# EasyEDA Pro project ProPrj_主控板v1.0_2025-02-24.epro, board PCB1
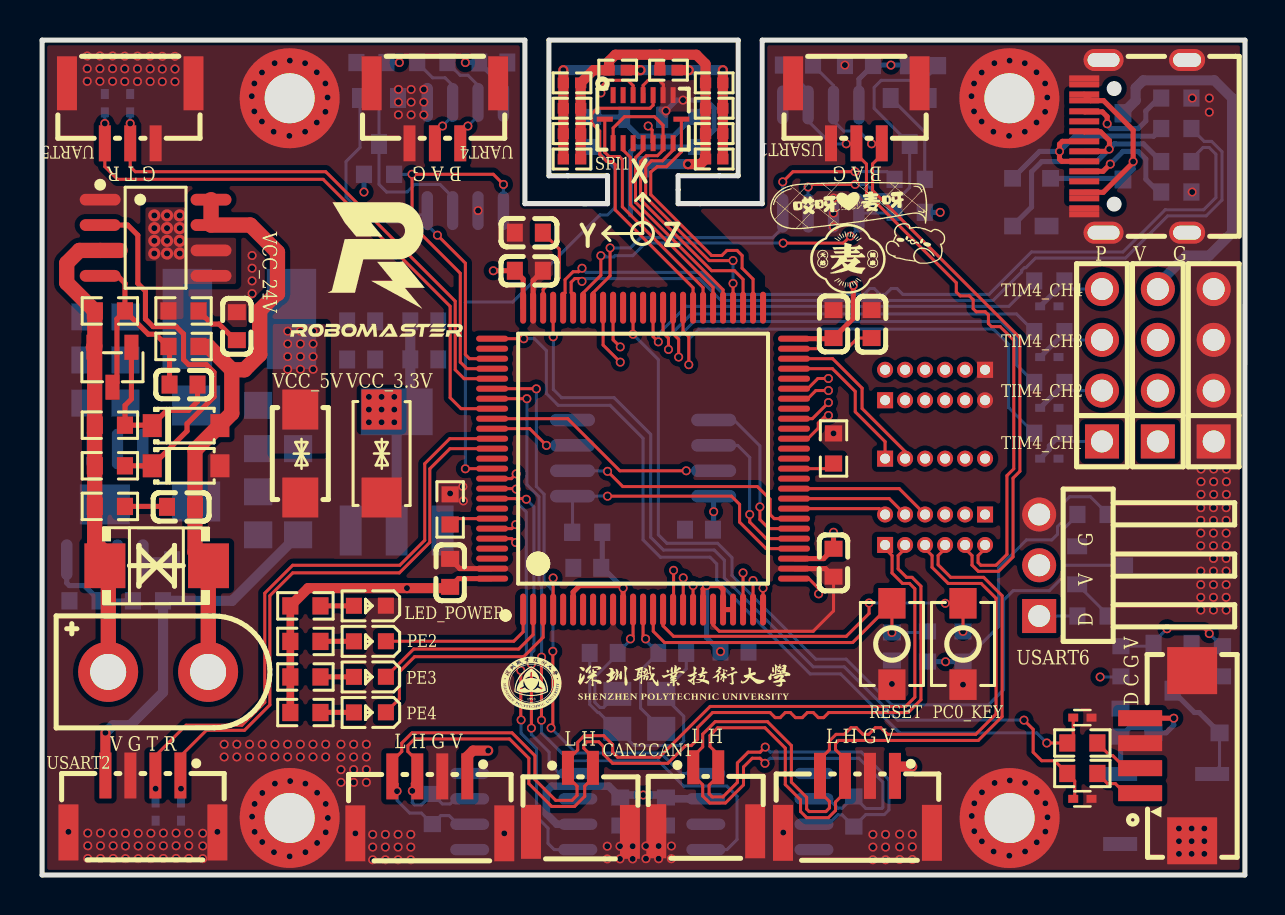
[diagram p8: board, top side]
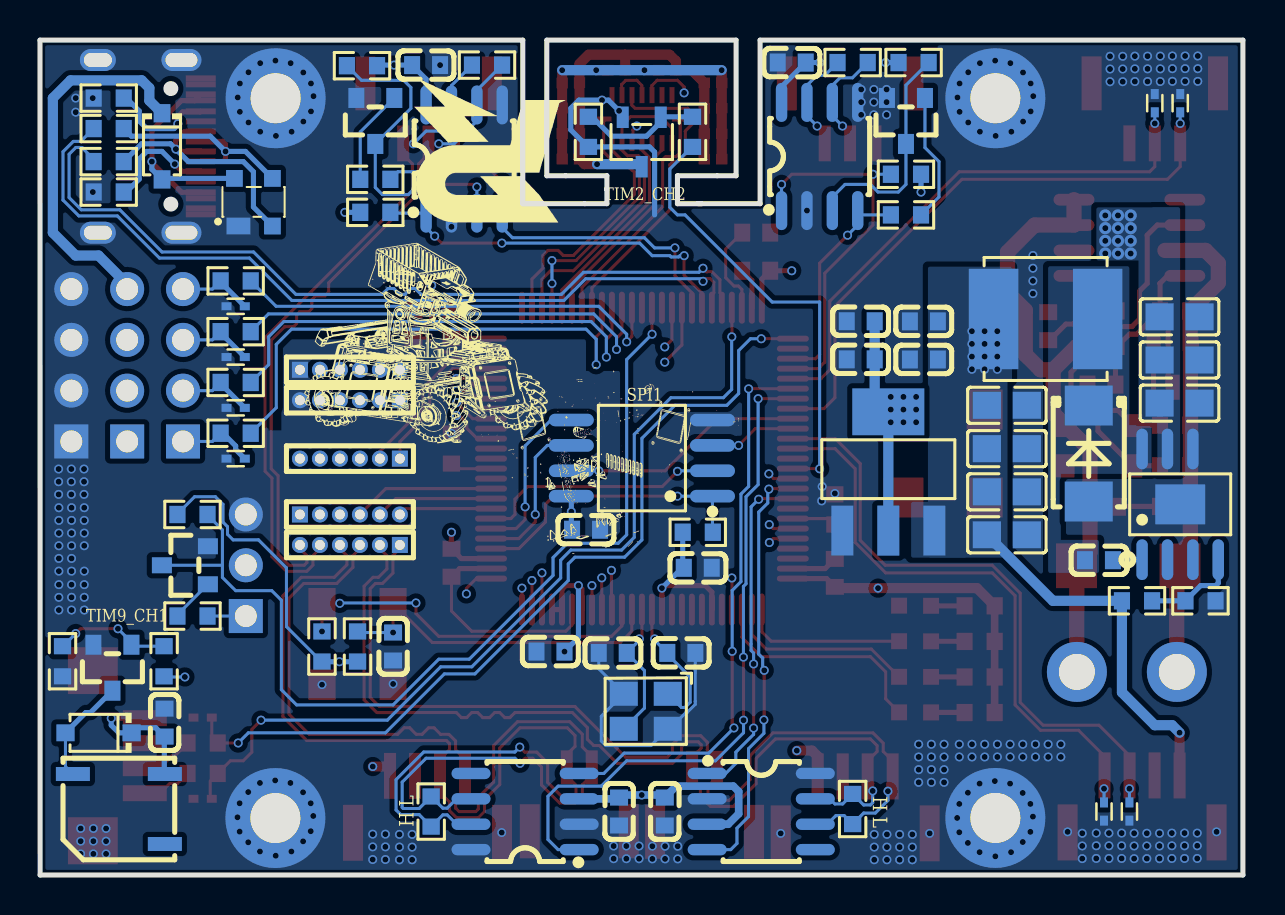
[diagram p9: board, bottom side, seen from below]

Outline 60.17 x 41.76 mm; copper layers: Top Layer, Inner1, Inner2, Bottom Layer. Coordinates in mm from the lower left corner of the outline.
Outline path: 27.24,33.58 24.15,33.58 24.15,41.76 0,41.76 0,0 60.16,0 60.17,41.76 36.02,41.76 36.02,33.58 31.81,33.58 31.81,34.98 34.82,34.98 34.82,41.76 25.35,41.76 25.35,34.98 28.28,34.98 28.28,33.58 27.07,33.58
Stack: Top Layer 0.035mm 外层铜厚1oz / Dielectric1 0.2104mm 7628 RC49% 8.6mil / Inner1 0.0152mm 内层铜厚 / Dielectric2 1.065mm 1.1mm H/HOZ 含铜 / Inner2 0.0152mm 内层铜厚 / Dielectric3 0.2104mm 7628 RC49% 8.6mil / Bottom Layer 0.035mm 外层铜厚1oz

## Design rules (mm)
net OSC_IN: OSC
net OSC_OUT: OSC
net CAN1-H: CAN1
net CAN1-L: CAN1
net CAN2-H: CAN2
net CAN2-L: CAN2
net RS485_1_B: RS485_1
net RS485_1_A: RS485_1
net RS485_4_B: RS485_4
net RS485_4_A: RS485_4
net $1N15439: USB
net $1N15440: USB
template: 自定义配置
spacing copperThickness1oz (default): track to track 0.102, other pairs 0.152 to 0.3
spacing copperThickness2oz: track to track 0.203, other pairs 0.152 to 0.3
track width copperThickness1oz (default): min 0.127, default 0.254, max 2.54
track width copperThickness2oz: min 0.203, default 0.254, max 2.54
differential pair differentialPair (default): width min 0.127, default 0.254, max 2.54; gap min 0.152, default 0.152
via viaSize (default): diameter min 0.3, default 0.3, max 10; hole min 0.3, default 0.45, max 6.3

## Placement (name value [footprint] x y rotation side)
BUZZER2  4kHz  [BUZ-SMD_L5.0-W5.5-P4.60]  56.22 3.3 0 bottom
C1  100nF  [C0603]  7.07 24.53 180 top
C3  1uF  [C0603]  6.95 18.42 180 top
C4  1uF  [C0603]  9.74 27.45 90 top
C8  100nF  [C0603]  7.2 15.75 0 bottom
C17  12pF  [C0603]  28.09 11.11 180 bottom
C18  12pF  [C0603]  31.52 11.11 0 bottom
C19  100nF  [C0603]  42.51 11.43 270 bottom
C54  100nF  [C0603]  31.2 3.17 270 bottom
C132  4.7uf  [C0805]  3.17 23.6 0 bottom
C133  4.7uf  [C0805]  3.17 25.76 0 bottom
C163  4.7uf  [C0805]  3.17 27.92 0 bottom
C164  4.7uf  [C0805]  11.81 17.02 0 bottom
C165  4.7uf  [C0805]  11.81 19.17 0 bottom
C166  4.7uf  [C0805]  11.81 21.33 0 bottom
C167  4.7uf  [C0805]  11.81 23.5 0 bottom
C170  100nF  [C0603]  34.63 11.18 180 bottom
C171  100nF  [C0603]  20.41 15.11 270 top
C174  100nF  [C0603]  27.27 15.37 0 bottom
C175  100nF  [C0603]  39.59 27.56 270 top
C176  100nF  [C0603]  24.35 30.23 180 top
C177  100nF  [C0603]  39.59 15.62 90 top
C178  100nF  [C0603]  28.92 3.17 270 bottom
C179  10nF  [C0603]  19.12 27.7 180 bottom
C180  100nF  [C0603]  19.12 25.79 180 bottom
C181  100nF  [C0603]  15.96 27.69 180 bottom
C182  100nF  [C0603]  15.96 25.79 180 bottom
C183  22uF  [C0603]  53.94 7.62 270 bottom
C184  100nF  [C0603]  41.49 27.56 90 top
C185  100nF  [C0603]  24.35 32.13 180 top
C186  100nF  [C0603]  32.86 17.27 180 bottom
C187  100nF  [C0603]  40.86 40.51 180 bottom
C188  100nF  [C0603]  22.57 40.64 0 bottom
CN1  HC-1.25-4PWT  [CONN-SMD_4P-P1.25-HC-1.25-4PWT]  56.22 5.97 90 top
CN11  GH1.25-2P卧贴  [CONN-SMD_2P-P1.25_X1251WRS-02HF-LPSW]  33.19 3.79 0 top
CN12  GH1.25-2P卧贴  [CONN-SMD_2P-P1.25_X1251WRS-02HF-LPSW]  26.93 3.76 0 top
D4  -  [SMB_L4.6-W3.6-LS5.3-BI]  5.73 15.47 180 top
D5  SS34-SMB  [SMB_L4.4-W3.6-LS5.3-RD]  7.71 21.08 270 bottom
D6  ESD9B5.0ST5G  [SOD-923_L0.8-W0.6-LS1.0-BI]  52.03 7.87 180 top
D7  ESD9B5.0ST5G  [SOD-923_L0.8-W0.6-LS1.0-BI]  52.03 3.81 180 top
D8  PRTR5V0U2X  [SOT-143-4_L2.9-W1.3-P1.92-LS2.4-BL]  49.49 33.66 180 bottom
D10  ESD9B5.0ST5G  [SOD-923_L0.8-W0.6-LS1.0-BI]  50.38 20.83 180 bottom
D11  ESD9B5.0ST5G  [SOD-923_L0.8-W0.6-LS1.0-BI]  50.38 23.37 180 bottom
D12  ESD9B5.0ST5G  [SOD-923_L0.8-W0.6-LS1.0-BI]  50.38 25.91 180 bottom
D13  ESD9B5.0ST5G  [SOD-923_L0.8-W0.6-LS1.0-BI]  50.38 28.45 180 bottom
D19  ESD9B5.0ST5G  [SOD-923_L0.8-W0.6-LS1.0-BI]  3.14 38.61 270 bottom
D20  ESD9B5.0ST5G  [SOD-923_L0.8-W0.6-LS1.0-BI]  4.41 38.61 270 bottom
D21  SMAJ5.0CA  [SMA_L4.4-W2.8-LS5.1-BI]  12.92 21.08 90 top
D22  SMAJ3.3CA  [SMA_L4.3-W2.6-LS5.1-BI]  16.98 21.08 90 top
D23  ESD9B5.0ST5G  [SOD-923_L0.8-W0.6-LS1.0-BI]  6.95 3.17 90 bottom
D24  ESD9B5.0ST5G  [SOD-923_L0.8-W0.6-LS1.0-BI]  5.68 3.17 90 bottom
H2  -  [HDR-TH_4P-P2.54-V-M]  53.01 25.5 90 top
H3  -  [HDR-TH_4P-P2.54-V-M]  55.81 25.5 90 top
H4  -  [HDR-TH_4P-P2.54-V-M]  58.6 25.5 90 top
L2  15uH  [IND-SMD_L6.0-W6.0_SWPA6045S]  9.87 27.81 0 bottom
LED2  -  [LED_0603]  16.35 13.46 180 top
LED3  -  [LED_0603]  16.35 11.68 180 top
LED4  -  [LED_0603]  16.35 9.91 180 top
LED5  -  [LED_0603]  16.35 8.13 180 top
NOREF  -  [Pad_e5542]  12.38 38.85 90 top
NOREF#2  -  [Pad_e5538]  48.38 38.86 90 top
NOREF#3  -  [Pad_e5541]  12.38 2.86 90 top
NOREF#4  -  [Pad_e5539]  48.39 2.85 90 top
Q6  -  [S8050_SOT-23]  52.92 15.37 180 bottom
Q29  NCE4614  [SOIC-8_L4.9-W3.9-P1.27-LS6.0-BL]  5.68 31.88 270 top
Q30  -  [SOT-23-3_L2.9-W1.3-P1.90-LS2.4-BR]  3.52 25.4 90 top
Q31  -  [S8050_SOT-23]  56.42 10.37 90 bottom
Q32  CJ2310  [SOT-23-3_L2.9-W1.6-P1.90-LS2.8-BR]  30.07 36.67 90 bottom
Q33  -  [S8050_SOT-23]  43.27 37.72 90 bottom
Q34  -  [S8050_SOT-23]  16.73 37.72 90 bottom
R2  100kΩ  [R0603]  3.39 20.47 180 top
R3  100kΩ  [R0603]  3.39 22.5 180 top
R4  22Ω  [R0603]  7.07 28.22 180 top
R6  10kΩ  [R0603]  3.39 28.22 180 top
R13  10K  [R0603]  44.29 11.43 270 bottom
R14  10K  [R0603]  13.17 13.46 0 top
R16  10K  [R0603]  20.41 18.29 270 top
R20  4.7k  [R0603]  5.3 13.72 0 bottom
R95  1.5k  [R0603]  2.12 13.72 0 bottom
R150  120R  [R0603]  19.52 3.3 90 bottom
R151  120R  [R0603]  40.6 3.17 270 bottom
R152  22Ω  [R0603]  3.39 18.44 180 top
R153  10kΩ  [R0603]  7.07 26.44 180 top
R154  4.7kΩ  [R0603]  52.54 18.03 180 bottom
R155  4.7kΩ  [R0603]  52.54 12.95 180 bottom
R156  22R  [R0603]  52.03 6.6 0 top
R157  22R  [R0603]  52.03 5.08 0 top
R158  10K  [R0603]  46.06 11.43 270 bottom
R159  10K  [R0603]  59.04 10.69 270 bottom
R160  22R  [R0603]  53.96 10.69 90 bottom
R161  22R  [R0603]  56.73 38.86 180 bottom
R162  22R  [R0603]  56.73 34.16 0 bottom
R163  100R  [R0603]  27.53 37.17 90 bottom
R164  10K  [R0603]  32.74 37.17 270 bottom
R165  470R  [R0402]  26.51 37.08 180 top
R166  470R  [R0402]  26.51 38.35 180 top
R167  470R  [R0402]  26.51 39.62 180 top
R168  470R  [R0402]  28.79 40.26 0 top
R169  470R  [R0402]  31.33 40.26 0 top
R170  470R  [R0402]  33.62 39.62 0 top
R171  470R  [R0402]  33.62 38.35 0 top
R172  470R  [R0402]  33.62 37.08 0 top
R173  470R  [R0402]  33.62 35.81 0 top
R174  470R  [R0402]  26.51 35.81 180 top
R175  10K  [R0603]  13.17 11.68 0 top
R176  10K  [R0603]  13.17 9.91 0 top
R177  10K  [R0603]  13.17 8.13 0 top
R178  22R  [R0603]  50.38 22.1 0 bottom
R179  22R  [R0603]  50.38 24.64 0 bottom
R180  22R  [R0603]  50.38 27.18 0 bottom
R181  22R  [R0603]  50.38 29.72 0 bottom
R182  22R  [R0603]  56.73 37.34 0 bottom
R183  22R  [R0603]  56.73 35.69 0 bottom
R184  10K  [R0603]  27.27 17.14 0 bottom
R185  10k  [R0603]  43.4 33.15 0 bottom
R186  120R  [R0603]  37.81 40.51 0 bottom
R187  10k  [R0603]  44.06 40.48 180 bottom
R188  10k  [R0603]  43.4 34.8 180 bottom
R189  10k  [R0603]  16.85 35.05 180 bottom
R190  120R  [R0603]  19.52 40.64 0 bottom
R191  10k  [R0603]  16.47 40.64 0 bottom
R192  10k  [R0603]  16.85 33.02 0 bottom
R193  10K  [R0603]  39.59 21.34 270 top
SW1  轻触按键3*4*H  [SW-SMD_L4.0-W2.9-LS5.0]  42.51 11.56 90 top
SW2  轻触按键3*4*H  [SW-SMD_L4.0-W2.9-LS5.0]  46.06 11.56 270 top
U1  STM32F407VET6  [LQFP-100_L14.0-W14.0-P0.50-LS16.0-BL]  30.06 20.83 0 top
U4  -  [SOIC-8_L5.0-W4.0-P1.27-LS6.0-BL-EP2.0]  3.14 18.54 180 bottom
U9  BMI088  [LGA-16_L4.5-W3.0-P0.50-BL]  30.06 37.81 270 top
U10  -  [SOIC-8_L5.0-W4.0-P1.27-LS6.0-BL]  24.09 3.17 270 bottom
U12  -  [SOIC-8_L5.0-W4.0-P1.27-LS6.0-BL]  35.9 3.17 90 bottom
U15  AMS1117-3.3  [SOT-223-3_L6.5-W3.4-P2.30-LS7.0-BR]  17.74 20.2 270 bottom
U18  X6511WR-03H-C30D60R2  [HDR-TH_3P-P2.54-H-M-W9.7-N]  49.87 15.49 90 top
U19  SD103AWS  [SOD-123_L2.7-W1.7-LS3.8-RD]  57.24 7.11 0 bottom
U20  SD103AWS  [SOD-123_L2.7-W1.7-LS3.8-RD]  54.06 36.45 270 bottom
U22  W25Q64JVSSIQ  [SOIC-8_L5.3-W5.3-P1.27-LS8.0-BL]  30.06 20.86 90 bottom
U24  SP3485EN-L/TR  [SOIC-8_L5.0-W4.0-P1.27-LS6.0-BL]  38.95 35.81 180 bottom
U27  SP3485EN-L/TR  [SOIC-8_L5.0-W4.0-P1.27-LS6.0-BL]  21.17 35.94 180 bottom
U31  GH1.25-4P卧贴  [CONN-SMD_4P-P1.25_GH1.25-4P]  19.39 3.51 0 top
U32  GH1.25-4P卧贴  [CONN-SMD_4P-P1.25_GH1.25-4P]  40.78 3.53 0 top
U33  GH1.25-4P卧贴  [CONN-SMD_4P-P1.25_GH1.25-4P]  5.04 3.56 0 top
U34  GH1.25-3PWBPZ  [CONN-SMD_GH1.25-3PWBPZ]  40.73 38.1 180 top
U35  GH1.25-3PWBPZ  [CONN-SMD_GH1.25-3PWBPZ]  19.65 38.1 180 top
U36  GH1.25-3PWBPZ  [CONN-SMD_GH1.25-3PWBPZ]  4.41 38.1 180 top
U37  XT30AW-M.G.Y  [CONN-TH_XT30AW-M.G.Y]  5.8 10.16 0 top
U38  HX PZ1.0-1x6P ZZ  [HDR-TH_6P-P1.00-V-M]  44.67 20.83 0 bottom
U39  HX PZ1.0-1x6P ZZ  [HDR-TH_6P-P1.00-V-M]  44.67 18.03 180 bottom
U40  HX PZ1.0-1x6P ZZ  [HDR-TH_6P-P1.00-V-M]  44.67 16.51 0 bottom
U41  HX PZ1.0-1x6P ZZ  [HDR-TH_6P-P1.00-V-M]  44.67 25.27 180 bottom
U42  HX PZ1.0-1x6P ZZ  [HDR-TH_6P-P1.00-V-M]  44.67 23.75 0 bottom
USB1  TYPE-C母座16P不绣钢  [TYPE-C-SMD_16P-EH4]  54.7 36.45 90 top
X3  12MHz  [OSC-SMD_4P-L3.2-W2.5-BL]  29.87 8.19 0 bottom
ZD1  MMSZ5239B  [SOD-123_L2.8-W1.8-LS3.7-RD]  7.2 20.47 0 top
ZD3  MMSZ5256B  [SOD-123_L2.8-W1.8-LS3.7-RD]  7.2 22.48 0 top

## Footprints (pads in the part's own frame, mm; a bottom-side part is the same pattern mirrored in y, then rotated)
BUZ-SMD_L5.0-W5.5-P4.60
  rect 1.7x0.7 smd: 1(-2.3,-1.75) 2(2.3,-1.75) 3(-2.3,1.75)
C0603
  rect 0.8x0.9 smd: 1(-0.7,0) 2(0.7,0)
C0805
  rect 1.41x1.35 smd: 1(-1,0) 2(1,0)
CONN-SMD_2P-P1.25_X1251WRS-02HF-LPSW
  rect 0.6x1.7 smd: 1(-0.625,1.6) 2(0.625,1.6)
  rect 1x2.7 smd: 3(2.475,-1.6) 4(-2.475,-1.6)
CONN-SMD_4P-P1.25-HC-1.25-4PWT
  rect 0.8x2.2 smd: 1(-1.875,1.3) 2(-0.625,1.3) 3(0.625,1.3) 4(1.875,1.3)
  rect 2.35x2.5 smd: 5(4.255,-1.3) 6(-4.255,-1.3)
CONN-SMD_4P-P1.25_GH1.25-4P
  rect 0.6x2.3 smd: 1(1.875,1.425) 2(0.625,1.425) 3(-0.625,1.425) 4(-1.875,1.425)
  rect 1x2.8 smd: 5(-3.725,-1.425) 6(3.725,-1.425)
CONN-SMD_GH1.25-3PWBPZ
  rect 0.6x1.8 smd: 1(-1.27,1.501) 2(0,1.501) 3(1.27,1.501)
  rect 1x2.7 smd: 4(-3.163,-1.501) 5(3.163,-1.501)
CONN-TH_XT30AW-M.G.Y
  round 3 hole 1.8: 1(-2.5,0) 2(2.5,0)
HDR-TH_3P-P2.54-H-M-W9.7-N
  rect 1.7x1.7 hole 1.1: 1(-2.54,0)
  round 1.7 hole 1.1: 2(0,0) 3(2.54,0)
HDR-TH_4P-P2.54-V-M
  rect 1.7x1.7 hole 1.1: 1(-3.81,0)
  round 1.7 hole 1.1: 2(-1.27,0) 3(1.27,0) 4(3.81,0)
HDR-TH_6P-P1.00-V-M
  rect 0.8x0.8 hole 0.5: 1(-2.5,0)
  round 0.8 hole 0.5: 2(-1.5,0) 3(-0.5,0) 4(0.5,0) 5(1.5,0) 6(2.5,0)
IND-SMD_L6.0-W6.0_SWPA6045S
  rect 2.474x5.02 smd: 1(-2.603,0) 2(2.603,0)
LED_0603
  rect 0.8x0.8 smd: 1(-0.851,-0.01) 2(0.75,-0.005)
LGA-16_L4.5-W3.0-P0.50-BL
  rect 0.8x0.25 smd: 1(-1.2,-1.498) 2(-1.2,-0.998) 3(-1.2,-0.498) 4(-1.2,0.002) 5(-1.2,0.502) 6(-1.2,1.002) 7(-1.2,1.502) 9(1.2,1.502) 10(1.2,1.002) 11(1.2,0.502) 12(1.2,0.002) 13(1.2,-0.498) 14(1.2,-0.998) 15(1.2,-1.498)
  rect 0.25x0.8 smd: 8(0,1.915) 16(0,-1.915)
LQFP-100_L14.0-W14.0-P0.50-LS16.0-BL
  oval 0.3x1.6 smd: 1(-6,-7.55) 2(-5.5,-7.55) 3(-5,-7.55) 4(-4.5,-7.55) 5(-4,-7.55) 6(-3.5,-7.55) 7(-3,-7.55) 8(-2.5,-7.55) 9(-2,-7.55) 10(-1.5,-7.55) 11(-1,-7.55) 12(-0.5,-7.55) 13(0,-7.55) 14(0.5,-7.55) 15(1,-7.55) 16(1.5,-7.55) 17(2,-7.55) 18(2.5,-7.55) 19(3,-7.55) 20(3.5,-7.55) 21(4,-7.55) 22(4.5,-7.55) 23(5,-7.55) 24(5.5,-7.55) 25(6,-7.55) 51(6,7.55) 52(5.5,7.55) 53(5,7.55) 54(4.5,7.55) 55(4,7.55) 56(3.5,7.55) 57(3,7.55) 58(2.5,7.55) 59(2,7.55) 60(1.5,7.55) 61(1,7.55) 62(0.5,7.55) 63(0,7.55) 64(-0.5,7.55) 65(-1,7.55) 66(-1.5,7.55) 67(-2,7.55) 68(-2.5,7.55) 69(-3,7.55) 70(-3.5,7.55) 71(-4,7.55) 72(-4.5,7.55) 73(-5,7.55) 74(-5.5,7.55) 75(-6,7.55)
  oval 1.6x0.3 smd: 26(7.55,-6) 27(7.55,-5.5) 28(7.55,-5) 29(7.55,-4.5) 30(7.55,-4) 31(7.55,-3.5) 32(7.55,-3) 33(7.55,-2.5) 34(7.55,-2) 35(7.55,-1.5) 36(7.55,-1) 37(7.55,-0.5) 38(7.55,0) 39(7.55,0.5) 40(7.55,1) 41(7.55,1.5) 42(7.55,2) 43(7.55,2.5) 44(7.55,3) 45(7.55,3.5) 46(7.55,4) 47(7.55,4.5) 48(7.55,5) 49(7.55,5.5) 50(7.55,6) 76(-7.55,6) 77(-7.55,5.5) 78(-7.55,5) 79(-7.55,4.5) 80(-7.55,4) 81(-7.55,3.5) 82(-7.55,3) 83(-7.55,2.5) 84(-7.55,2) 85(-7.55,1.5) 86(-7.55,1) 87(-7.55,0.5) 88(-7.55,0) 89(-7.55,-0.5) 90(-7.55,-1) 91(-7.55,-1.5) 92(-7.55,-2) 93(-7.55,-2.5) 94(-7.55,-3) 95(-7.55,-3.5) 96(-7.55,-4) 97(-7.55,-4.5) 98(-7.55,-5) 99(-7.55,-5.5) 100(-7.55,-6)
OSC-SMD_4P-L3.2-W2.5-BL
  rect 1.4x1.2 smd: 1(-1.1,-0.875) 2(1.1,-0.875) 3(1.1,0.875) 4(-1.1,0.875)
Pad_e5538
  round 5 hole 2.5: 101(0,0)
Pad_e5539
  round 5 hole 2.5: 101(0,0)
Pad_e5541
  round 5 hole 2.5: 101(0,0)
Pad_e5542
  round 5 hole 2.5: 101(0,0)
R0402
  rect 0.566x0.54 smd: 1(-0.433,0) 2(0.433,0)
R0603
  rect 0.806x0.864 smd: 1(-0.753,0) 2(0.753,0)
S8050_SOT-23
  rect 1x0.8 smd: 1(1.15,-0.823) 2(1.15,1.077) 3(-1.15,0.127)
SMA_L4.3-W2.6-LS5.1-BI
  rect 2x2 smd: 1(-2.2,0) 2(2.2,0)
SMA_L4.4-W2.8-LS5.1-BI
  rect 2x1.8 smd: 1(-2.2,0) 2(2.2,0)
SMB_L4.4-W3.6-LS5.3-RD
  rect 2x2.4 smd: 1(-2.4,0) 2(2.4,0)
SMB_L4.6-W3.6-LS5.3-BI
  rect 2.047x2.24 smd: 1(-2.591,0) 2(2.591,0)
SOD-123_L2.7-W1.7-LS3.8-RD
  rect 0.91x0.84 smd: 1(-1.655,0) 2(1.655,0)
SOD-123_L2.8-W1.8-LS3.7-RD
  rect 0.95x1.15 smd: 1(-1.692,0) 2(1.692,0)
SOD-923_L0.8-W0.6-LS1.0-BI
  rect 0.5x0.4 smd: 1(-0.457,0) 2(0.457,0)
SOIC-8_L4.9-W3.9-P1.27-LS6.0-BL
  oval 0.588x2.045 smd: 1(-1.905,-2.772) 2(-0.635,-2.772) 3(0.635,-2.772) 4(1.905,-2.772) 5(1.905,2.772) 6(0.635,2.772) 7(-0.635,2.772) 8(-1.905,2.772)
SOIC-8_L5.0-W4.0-P1.27-LS6.0-BL
  oval 0.569x1.95 smd: 1(-1.905,-2.705) 2(-0.635,-2.705) 3(0.635,-2.705) 4(1.905,-2.705) 5(1.905,2.705) 6(0.635,2.705) 7(-0.635,2.705) 8(-1.905,2.705)
SOIC-8_L5.0-W4.0-P1.27-LS6.0-BL-EP2.0
  oval 0.574x2.037 smd: 1(-1.905,-2.768) 2(-0.635,-2.768) 3(0.635,-2.768) 4(1.905,-2.768) 6(0.635,2.768) 7(-0.635,2.768) 8(-1.905,2.768)
  rect 2.5x2 smd: 9(0,0)
SOIC-8_L5.3-W5.3-P1.27-LS8.0-BL
  oval 0.63x2.25 smd: 1(-1.905,-3.53) 2(-0.635,-3.53) 3(0.635,-3.53) 4(1.905,-3.53) 5(1.905,3.53) 6(0.635,3.53) 7(-0.635,3.53) 8(-1.905,3.53)
SOT-23-3_L2.9-W1.3-P1.90-LS2.4-BR
  rect 1.25x0.7 smd: 1(1,-0.95) 2(1,0.95) 3(-1,0)
SOT-23-3_L2.9-W1.6-P1.90-LS2.8-BR
  rect 1.07x0.6 smd: 1(1.235,-0.95) 2(1.235,0.95) 3(-1.235,0)
SOT-143-4_L2.9-W1.3-P1.92-LS2.4-BL
  rect 1.194x0.838 smd: 1(-0.75,-1.192)
  rect 0.838x0.838 smd: 2(0.95,-1.192) 3(0.95,1.192) 4(-0.95,1.192)
SOT-223-3_L6.5-W3.4-P2.30-LS7.0-BR
  rect 2.5x1.1 smd: 1(2.97,-2.3) 2(2.97,0) 3(2.97,2.3)
  rect 2.34x3.6 smd: 4(-2.97,0)
SW-SMD_L4.0-W2.9-LS5.0
  rect 1.53x1.36 smd: 1(-2.035,0) 2(2.035,0)
TYPE-C-SMD_16P-EH4
  oval 1.1x2 hole 0.7x1.6: 1(-4.32,1.606) 1(4.32,1.606)
  oval 1.1x1.8 hole 0.7x1.4: 1(-4.32,-2.574) 1(4.32,-2.574)
  rect 0.3x1.5 smd: A1(-3.4,2.573) A4(-2.6,2.573) A5(-1.25,2.573) A6(-0.25,2.573) A7(0.25,2.573) A8(1.25,2.574) A9(2.6,2.574) A12(3.4,2.573) B1(3.1,2.573) B4(2.3,2.574) B5(1.75,2.573) B6(0.75,2.573) B7(-0.75,2.573) B8(-1.75,2.574) B9(-2.3,2.573) B12(-3.1,2.573)

## Nets
As in the schematic, except:
GND: C4.2 C17.2 C18.2 C19.2 C54.2 C132.1 C133.1 C163.1 C164.1 C165.1 C166.1 C167.1 C170.1 C171.1 C174.1 C175.1 C176.1 C177.1 C178.2 C179.1 C180.1 C181.1 C182.1 C183.1 C184.2 C185.2 C186.2 C187.2 C188.2 CN1.3 CN1.5 CN1.6 CN11.3 CN11.4 CN12.3 CN12.4 D5.2 D6.1 D7.1 D8.1 D10.1 D11.1 D12.1 D13.1 D19.1 D20.1 D21.1 D22.1 D23.1 D24.1 H4.1 H4.2 H4.3 H4.4 LED2.1 NOREF.101 NOREF#2.101 NOREF#3.101 NOREF#4.101 Q6.2 Q29.1 Q31.2 Q32.2 Q33.2 Q34.2 R16.1 R95.1 R159.2 R161.1 R162.2 R164.2 R193.1 SW1.1 SW2.2 U1.10 U1.20 U1.27 U1.74 U1.99 U4.6 U4.9 U9.4 U9.6 U9.7 U10.2 U10.8 U12.2 U12.8 U15.1 U18.3 U22.4 U24.2 U24.5 U27.2 U27.5 U31.2 U31.5 U31.6 U32.2 U32.5 U32.6 U33.3 U33.5 U33.6 U34.3 U34.4 U34.5 U35.3 U35.4 U35.5 U36.1 U36.4 U36.5 U41.1 U42.6 USB1.1 USB1.A1 USB1.A12 USB1.B1 USB1.B12 X3.2 X3.4 ZD1.2

Pads without a net: BUZZER2 3; U1 5 7 8 9 36 38 39 41 43 46 51 63 65 77 88 90 93 97 98; U4 2 3; U9 1 2 13; U10 5; U12 5; USB1 A8 B8

## Via types
v1: diameter 0.45, hole 0.3, Top Layer to Bottom Layer, 396 vias
v2: diameter 0.61, hole 0.305, Top Layer to Bottom Layer, 12 vias

## Routing (per net, layer and track width the routed paths; a pad name or vN(x,y) marks a point on that pad's centre or on a via; arc(x,y) is an arc through that point)
5V_FB: length 4.8
  Bottom Layer w0.254: R20.1 R95.2 2.11,14.48 1.36,14.48 1.23,14.61 1.23,15.77
GND: length 43.1
  Top Layer w0.152: U9.4 30.06,39.5 30.32,39.75 30.87,39.75 31.08,39.54 31.08,39.02 U9.6 ; C177.1 39.59,13.21 38.57,12.19 33.87,12.19 33.56,12.5 U1.20
  Top Layer w0.254: U1.27 39.18,15.33 C177.1 ; C176.1 24.56,29.74 U1.74 ; U1.99 20.89,15.33 C171.1
  Bottom Layer w0.152: C18.2 32.22,10.31 30.97,9.06 32.09,7.94 32.09,6.71 31.87,6.48 29.61,6.48 X3.4 28.67,7.31 27.85,8.13 27.8,8.13 27.39,8.53 27.39,8.69 27.39,8.69 C17.2
  Bottom Layer w0.254: v1(31.2,38.23) 31.74,38.76 v1(32.06,38.76) 33.21,38.76 33.62,38.35 33.62,37.27 32.77,36.42 R164.2 29.68,36.42 29.43,36.17 29.43,33.02
  vias: v1(1.32,2.16) v1(2.26,40.97) v1(2.26,40.33) v1(2.26,39.7) v1(2.28,2.1) v1(2.28,1.46) v1(2.28,0.83) v1(2.89,40.97) v1(2.89,40.33) v1(2.89,39.7) v1(2.92,2.1) v1(2.92,1.46) v1(2.92,0.83) v1(3.53,40.97) v1(3.53,40.33) v1(3.53,39.7) v1(3.55,2.1) v1(3.55,1.46) v1(3.55,0.83) v1(4.13,40.96) v1(4.13,40.33) v1(4.13,39.69) v1(4.17,2.09) v1(4.17,1.45) v1(4.17,0.82) v1(4.77,40.96) v1(4.77,40.33) v1(4.77,39.69) v1(4.81,2.09) v1(4.81,1.45) v1(4.81,0.82) v1(5.4,40.96) v1(5.4,40.33) v1(5.4,39.69) v1(5.44,2.09) v1(5.44,1.45) v1(5.44,0.82) v1(6.01,40.95) v1(6.01,40.32) v1(6.01,39.68) v1(6.07,2.1) v1(6.07,1.46) v1(6.07,0.83) v1(6.65,40.95) v1(6.65,40.32) v1(6.65,39.68) v1(6.7,2.1) v1(6.7,1.46) v1(6.7,0.83) v1(7.34,2.1) v1(7.34,1.46) v1(7.34,0.83) v1(8.04,2.09) v1(8.04,1.45) v1(8.04,0.82) v1(8.77,2.16) v1(9.11,6.54) v1(9.11,5.91) v1(9.74,6.54) v1(9.74,5.91) v1(10.38,6.54) v1(10.38,5.91) v1(10.49,38.96) v1(10.5,30.99) v1(10.5,30.35) v1(10.5,29.72) v1(10.5,29.08) v1(10.5,2.92) v1(10.62,39.59) v1(10.62,38.2) v1(10.63,3.56) v1(10.63,2.16) v1(11,40.14) v1(11,37.69) v1(11.01,6.54) v1(11.01,5.91) v1(11.01,1.65) v1(11.01,4.11) v1(11.58,37.18) v1(11.6,1.14) v1(11.63,40.61) v1(11.65,6.54) v1(11.65,5.91) v1(11.65,4.57) v1(12.28,6.54) v1(12.28,5.91) v1(12.39,40.74) v1(12.37,36.97) v1(12.41,4.7) v1(12.38,0.93) v1(12.92,6.54) v1(12.92,5.91) v1(13.16,40.61) v1(13.16,37.18) v1(13.17,4.57) v1(13.17,1.14) v1(13.55,6.54) v1(13.55,5.91) v1(13.74,40.15) v1(13.74,37.64) v1(13.76,4.12) v1(13.76,1.6) v1(14.17,39.59) v1(14.17,38.18) v1(14.19,6.54) v1(14.19,5.91) v1(14.19,3.56) v1(14.19,2.14) v1(14.28,38.89) v1(14.29,2.86) v1(14.95,6.54) v1(14.95,5.91) v1(14.95,5.27) v1(14.95,4.64) v1(15.58,6.54) v1(15.58,5.91) v1(15.58,5.27) v1(15.58,4.64) v1(15.67,2.08) v1(16.22,6.54) v1(16.22,5.91) v1(16.22,5.27) v1(16.22,4.64) v1(16.54,2.03) v1(16.54,1.4) v1(16.54,0.76) v1(17.17,2.03) v1(17.17,1.4) v1(17.17,0.76) v1(17.81,2.03) v1(17.81,1.4) v1(17.81,0.76) v1(17.82,39.3) v1(17.82,38.66) v1(17.82,38.03) v1(18.46,39.3) v1(18.46,38.66) v1(18.46,38.03) v1(18.44,2.03) v1(18.44,1.4) v1(18.44,0.76) v1(19.09,39.3) v1(19.09,38.66) v1(19.09,38.03) v1(20.41,19.09) v1(21.04,19.43) v1(21.07,18.71) v1(21.81,33.24) v1(23.12,2.08) v1(28.27,1.44) v1(28.27,0.81) v1(28.9,1.44) v1(28.9,0.81) v1(29.54,1.44) v1(29.54,0.81) v1(30.2,1.45) v1(30.2,0.82) v1(30.84,1.45) v1(30.84,0.82) v1(31.47,1.45) v1(31.47,0.82) v1(37.07,2.12) v1(39.59,33.86) v1(39.59,33.11) v1(39.59,32.42) v1(39.59,22.09) v1(40.16,40.51) v1(41.56,2.03) v1(41.56,1.4) v1(41.56,0.76) v1(42.19,2.03) v1(42.19,1.4) v1(42.19,0.76) v1(42.51,9.56) v1(42.89,2.04) v1(42.89,1.41) v1(42.89,0.77) v1(43.53,2.04) v1(43.53,1.41) v1(43.53,0.77) v1(46.06,9.52) v1(46.49,38.96) v1(46.5,2.95) v1(46.61,39.59) v1(46.61,38.2) v1(46.63,3.59) v1(46.63,2.19) v1(47,40.14) v1(47,37.69) v1(47.01,4.14) v1(47.01,1.68) v1(47.58,37.18) v1(47.59,1.18) v1(47.63,40.61) v1(47.64,4.61) v1(48.39,40.74) v1(48.37,36.97) v1(48.41,4.73) v1(48.38,0.97) v1(49.15,40.61) v1(49.15,37.18) v1(49.17,4.61) v1(49.17,1.18) v1(49.74,40.15) v1(49.74,37.64) v1(49.75,4.15) v1(49.75,1.64) v1(50.17,39.59) v1(50.17,38.18) v1(50.18,3.59) v1(50.18,2.17) v1(50.28,38.89) v1(50.29,2.89) v1(56.86,2.33) v1(56.86,1.69) v1(56.86,1.06) v1(57.5,2.33) v1(57.5,1.69) v1(57.5,1.06) v1(57.53,38.86) v1(57.53,34.16) v1(57.97,20.31) v1(57.97,19.67) v1(57.97,19.04) v1(57.96,18.37) v1(57.96,17.74) v1(57.96,17.1) v1(57.96,16.47) v1(57.96,15.2) v1(57.96,14.52) v1(57.96,13.89) v1(57.96,13.25) v1(58.13,2.33) v1(58.13,1.69) v1(58.13,1.06) v1(58.38,38.86) v1(58.38,38.16) v1(58.6,20.31) v1(58.6,19.67) v1(58.6,19.04) v1(58.59,18.37) v1(58.59,17.74) v1(58.59,17.1) v1(58.59,16.47) v1(58.59,15.84) v1(58.59,15.2) v1(58.59,14.52) v1(58.59,13.89) v1(58.59,13.25) v1(59.24,20.31) v1(59.24,19.67) v1(59.24,19.04) v1(59.23,18.37) v1(59.23,17.74) v1(59.23,17.1) v1(59.23,16.47) v1(59.23,15.84) v1(59.23,15.2) v1(59.23,14.52) v1(59.23,13.89) v1(59.23,13.25)
VCC_3.3V: length 129.8
  Top Layer w0.152: U9.11 30.51,36.66 30.51,37.27 v1(30.32,37.47) ; v1(27.95,39.12) 27.95,39.42 28.28,39.75 29.3,39.75 29.56,39.49 U9.3
  Top Layer w0.254: U1.28 39.09,15.83 39.59,16.32 v1(39.59,17.14) ; v1(22.57,30.23) C176.2 24.06,29.81 U1.75 ; U1.50 39.56,26.83 40.58,27.85 v1(40.58,29.5) ; U1.11 v1(29.06,14.35) 28.93,14.48 26.89,14.48 26.56,14.15 U1.6 ; CN1.4 v1(56.6,7.84) ; U1.100 20.82,14.83 C171.2 ; U1.22 U1.21 34.06,14.29 33.87,14.48 v1(33.24,14.48) 33.06,14.3 U1.19
  Top Layer w0.381: R177.1 R176.1 R175.1 R14.1
  Top Layer w0.508: C171.2 20.35,14.35 v1(18.25,14.35) 13.31,14.35 R14.1
  Inner1 w0.508: v1(45.19,10.67) 53.81,10.67 54.95,9.53 55.97,9.53 56.6,8.89 v1(56.6,7.84) ; v1(27.95,39.12) 29.3,39.12 30.32,38.11 v1(30.32,37.47) 30.3,37.47 29.06,36.23 29.06,33.39 28.19,32.51 23.46,32.51 22.31,33.66 22.31,39.5 v1(21.17,40.64) v1(17.87,40.64)
  Bottom Layer w0.152: R154.1 53.29,18.06 52.43,18.92 51.4,18.92 51.02,18.54 51.02,17.65 50.79,17.43 50.79,17.04 50.51,16.76 49.24,16.76 47.84,15.37 47.84,12.43 46.09,10.68
  Bottom Layer w0.254: R158.2 46.07,10.67 v1(45.19,10.67) 44.29,10.67 R13.2 ; U22.8 v1(33.59,18.17) 33.59,17.31 C186.1 ; U24.8 40.86,39.81 41.56,40.51 v1(42.46,40.51) 43.28,40.51 R187.2 ; R189.2 v1(16.1,34.16) ; v1(33.93,11.18) 33.24,11.87 v1(33.24,14.48) ; R191.2 v1(17.87,40.64) ; v1(21.17,40.64) C188.1 23.08,39.43 U27.8 ; v1(29.06,14.35) 28.05,15.37 C174.2 28.02,15.42 R184.2 ; v1(56.6,7.84) 56.6,7.49 56.22,7.11 U19.1 55.33,7.37 54.38,7.37 C183.2 53.95,6.91 53.95,5.08 ; R185.2 v1(44.92,33.15)
  Bottom Layer w0.508: U15.2 U15.4 18.42,23.85 C180.2 C179.2
  vias: v1(16.35,23.92) v1(16.35,23.28) v1(16.35,22.65) v1(16.98,23.92) v1(16.98,23.28) v1(16.98,22.65) v1(17.62,23.92) v1(17.62,23.28) v1(17.62,22.65)
VCC_5V: length 50.7
  Top Layer w0.508: v1(22.31,6.22) 21.55,6.22 21.25,5.92 21.25,5.4 ; 42.67,5.42 v1(43.52,5.42) ; v1(3.17,7.12) 3.17,5.46
  Bottom Layer w0.381: U12.3 31.27,3.81 C54.1 31.08,4 v1(30.07,4) 29.05,4 C178.1 28.35,4.45 25.49,4.45 25.22,4.18 25.22,3.06 25.74,2.54 U10.3
  Bottom Layer w0.508: v1(3.17,7.12) 3.54,7.49 4.41,7.49 6.05,9.14 R20.2 9.5,13.72 C164.2 ; H3.4 55.81,29.56 57.24,30.99 58.38,30.99 59.53,32.13 59.53,38.86 58.64,39.75 55.08,39.75 54.7,39.37 54.7,38.74 U20.1
  vias: v1(12.29,27.2) v1(12.29,26.57) v1(12.29,25.93) v1(12.29,25.3) v1(12.92,27.2) v1(12.92,26.57) v1(12.92,25.93) v1(12.92,25.3) v1(13.56,27.2) v1(13.56,26.57) v1(13.56,25.93) v1(13.56,25.3)
VCC_24V: length 18.2
  Top Layer w0.508: 29.22,40.26 v1(29.93,40.26) ; v1(26.07,40.26) R167.2 R166.2 R165.2 R174.2 ; v1(34.05,40.26) R170.2 R171.2 R172.2 R173.2 ; v1(32.35,40.26) R169.2
  Bottom Layer w0.508: v1(34.05,40.26) v1(32.35,40.26) v1(29.93,40.26) v1(26.07,40.26)
  vias: v2(5.61,32.99) v2(5.61,32.36) v2(5.61,31.72) v2(5.61,31.09) v2(6.25,32.99) v2(6.25,32.36) v2(6.25,31.72) v2(6.25,31.09) v2(6.88,32.99) v2(6.88,32.36) v2(6.88,31.72) v2(6.88,31.09)
(no net): length 1.3
  Top Layer w0.152: v1(23.71,20.07) 23.47,19.83 U1.90
ADC12_IN8: length 7.1
  Top Layer w0.152: U39.4 42.87,19.33 U1.35
ADC12_IN14: length 4.7
  Top Layer w0.152: U1.33 41.87,18.33 U39.6
ADC12_IN15: length 5.9
  Top Layer w0.152: U39.5 42.37,18.83 U1.34
ADC123_IN11: length 19.9
  Top Layer w0.152: v1(31.59,15.24) 31.59,13.3 U1.16
  Inner1 w0.152: U39.1 45.77,19.43 39.84,19.43 37.3,16.89 33.24,16.89 v1(31.59,15.24)
ADC123_IN12: length 17.9
  Top Layer w0.152: v1(32.07,14.86) 32.07,13.29 U1.17
  Inner1 w0.152: v1(32.07,14.86) 33.72,16.51 37.55,16.51 40.22,19.18 45.02,19.18 U39.2
ADC123_IN13: length 16
  Top Layer w0.152: v1(32.56,14.48) U1.18
  Inner1 w0.152: v1(32.56,14.48) 34.21,16.13 37.81,16.13 40.6,18.92 44.28,18.92 U39.3
BOOT0: length 2.2
  Top Layer w0.152: U1.94 20.7,17.83 R16.2
BOOT1: length 2.1
  Top Layer w0.152: U1.37 39.33,20.33 R193.2
CAN1-H: length 54
  Top Layer w0.152: v1(36.17,6.4) 35.92,6.15 35.32,6.15 34.78,5.61 34.78,4.63 34.05,3.91 33.52,3.91 33.36,4.06 33.36,4.49 33.82,4.95 33.82,6.02 33.41,6.43 33.41,6.98 33.79,7.37 36.16,7.37 37.17,6.35 37.17,4.52 37.94,3.76 37.94,3.18 38.24,2.87 39.33,2.87 39.69,3.23 39.69,3.66 40.16,4.13 40.16,5.8 39.69,6.27 39.69,6.58 39.84,6.73 46.83,6.73 48.02,7.92 48.02,13.97 47.1,14.89 45.45,14.89 44.82,15.52 44.82,15.98 45.17,16.33
  Bottom Layer w0.152: v1(36.17,6.4) 36.42,6.15 40.98,6.15 42.36,4.77 42.36,3.26 42.13,3.02 41.2,3.02 R151.2 40.02,3.01 39.8,3.01 39.33,2.54 U12.7
CAN1-L: length 54.1
  Top Layer w0.152: 46.7,7.04 47.71,8.05 47.71,13.84 46.97,14.59 45.32,14.59 44.51,15.39 44.51,15.98 44.17,16.33 ; v1(36.16,5.59) 35.9,5.84 35.52,5.84 35.08,5.4 35.08,4.51 34.18,3.6 33.39,3.6 33.04,3.95 33.04,4.51 32.57,4.98 32.57,5.94 33.04,6.41 33.04,7.05 33.67,7.67 36.28,7.67 37.48,6.48 37.48,4.65 38.24,3.89 38.24,3.3 38.37,3.17 39.21,3.17 39.38,3.35 39.38,3.68 38.91,4.15 U32.4 38.91,5.79 39.38,6.26 39.38,6.7 39.71,7.04 40.13,7.04 40.46,7.37 40.73,7.37 41.06,7.04 41.35,7.04 41.68,7.37 41.95,7.37 42.28,7.04 46.7,7.04
  Bottom Layer w0.152: v1(36.16,5.59) 36.41,5.84 40.86,5.84 42.05,4.64 42.05,3.38 42,3.33 41.2,3.33 R151.1 40.02,3.34 39.8,3.34 39.33,3.81 U12.6
CAN1_RX: length 28.2
  Top Layer w0.152: v1(25.55,11.19) 25.55,7.44 v1(25.46,7.36) ; v1(24.72,24.32) 24.71,24.33 U1.81
  Bottom Layer w0.152: v1(25.46,7.36) 26.72,6.1 30.95,6.1 31.97,5.08 U12.4 ; v1(24.72,24.32) 24.72,19.44 25.11,19.05 25.11,14.67 25.55,14.23 v1(25.55,11.19)
CAN1_TX: length 33.8
  Top Layer w0.152: v1(24.25,23.83) 24.25,23.83 U1.82 ; v1(24.98,7.74) 24.98,10.89 v1(24.98,10.9)
  Bottom Layer w0.152: v1(24.25,23.83) 24.25,19.53 24.85,18.92 24.85,14.57 24.98,14.44 v1(24.98,10.9) ; v1(24.98,7.74) 24.98,7.12 26.38,5.72 30.82,5.72 32.09,4.45 34.25,4.45 34.76,3.94 34.76,1.78 34.25,1.27 U12.1
CAN2-H: length 49.1
  Top Layer w0.152: 43.17,16.33 42.82,15.98 42.82,15.31 43.24,14.89 43.51,14.89 43.96,14.45 43.96,8.77 43.32,8.13 39.35,8.13 39.09,7.87 38.82,7.87 38.57,8.13 38.28,8.13 38.02,7.87 37.68,7.87 37.43,8.13 37.17,8.13 36.92,7.87 36.67,7.87 36.41,8.13 33.54,8.13 32.79,7.38 32.79,6.79 32.47,6.48 32.18,6.48 31.3,5.59 28.54,5.59 28.08,6.05 28.08,6.43 27.84,6.67 27.25,6.67 27.09,6.51 27.09,6.34 27.55,5.89 CN12.2 27.55,4.86 27.14,4.45 27.14,3.94 26.63,3.43 25.49,3.43 24.35,4.57 24.35,5.84 23.38,6.81 18.63,6.81 18.3,6.47 18.3,6.18 18.77,5.7 U31.3 18.77,4.84 18.52,4.59 v1(18.52,4.21)
  Bottom Layer w0.152: v1(18.52,4.21) 18.52,3.62 18.63,3.51 18.97,3.51 R150.2 20.02,3.56 20.41,3.56 20.66,3.81 U10.7
CAN2-L: length 49
  Top Layer w0.152: v1(17.75,4.19) 17.75,4.56 17.52,4.8 U31.4 17.52,5.71 17.99,6.18 17.99,6.6 18.5,7.11 23.51,7.11 24.65,5.97 24.65,4.78 25.69,3.73 26.51,3.73 26.76,3.99 26.76,4.45 26.3,4.9 CN12.1 26.43,5.49 26.43,5.89 26.79,6.25 26.79,6.64 27.12,6.97 28.09,6.97 28.54,6.53 28.54,6.15 28.79,5.89 30.87,5.89 33.41,8.43 43.19,8.43 43.65,8.89 43.65,14.32 43.39,14.59 43.04,14.59 42.51,15.11 42.51,15.98 42.17,16.33
  Bottom Layer w0.152: v1(17.75,4.19) 17.75,3.73 18.39,3.1 18.97,3.1 R150.1 19.94,2.97 20.36,2.97 20.79,2.54 U10.6
CAN2_RX: length 21.4
  Top Layer w0.152: v1(23.71,19.3) 23.69,19.33 U1.91 ; v1(23.94,10.24) 23.94,7.77 v1(23.96,7.76)
  Bottom Layer w0.152: v1(23.94,10.24) 24.02,10.32 24.02,10.86 24.03,10.86 24.22,11.05 24.22,18.16 23.77,18.61 23.77,19.25 v1(23.71,19.3) ; U10.4 25.62,1.27 25.31,1.58 25.31,2.34 24.73,2.92 24.73,6.32 23.96,7.09 v1(23.96,7.76)
CAN2_TX: length 17.2
  Top Layer w0.152: U1.92 24.19,18.83 v1(24.22,18.8) ; v1(24.47,10.56) v1(24.47,7.35)
  Bottom Layer w0.152: v1(24.47,10.56) 24.47,11.1 24.6,11.23 24.6,11.56 ; U10.1 25.87,5.08 25.36,5.59 25.36,6.14 24.47,7.03 v1(24.47,7.35) ; 24.6,11.56 24.6,18.42 v1(24.22,18.8)
CS1_ACCEL: length 15.7
  Top Layer w0.152: U9.5 30.56,38.51 30.41,38.35 27.78,38.35 27.49,38.07 27.49,37.62 27.89,37.22 27.89,36.05 28.25,35.69 28.51,35.69 28.66,35.53 28.66,33.27 32.56,29.38 U1.58
CS1_GYRO: length 10.1
  Top Layer w0.152: U9.14 29.06,36.26 29.43,35.9 29.43,33.53 33.56,29.39 U1.56
G1: length 11.7
  Top Layer w0.254: Q30.3 3.74,24.62 3.74,27.81 R6.1 ; C1.2 6.37,26.39 R153.2 6.29,26.44 5.68,27.05 5.31,27.05 R6.1 ; R6.1 4.14,29.58 4.15,29.59 3.77,29.97 Q29.4
G2: length 19
  Top Layer w0.254: R2.1 ZD1.1 7.25,22.21 7.25,22.57 8.6,23.92 8.6,25.15 8.22,25.53 7.33,25.53 7.07,25.78 7.07,27.07 6.71,27.43 5.55,27.43 5.17,27.81 5.17,29.21 4.79,29.59 4.79,32 4.28,32.51 Q29.2
GROUND: length 30.7
  Top Layer w0.762: Q29.8 Q29.7 10.41,32.51 11.77,31.15 11.77,29.08 11.72,29.08 10.88,28.25 10.88,26.03 10.12,25.27 9.49,25.27 ; 9.49,25.27 8.32,26.44 R153.1 ; 9.49,25.27 9.49,23.09 7.65,21.26 C3.1 7.65,16.14 D4.1 8.31,15.46 8.31,10.14
HOLD_RESET: length 12.2
  Top Layer w0.152: U1.84 26.29,22.83 28.9,20.22 v1(32.22,20.22)
  Bottom Layer w0.152: U22.7 v1(32.22,20.22)
I2C1_SCL: length 23.1
  Top Layer w0.152: U1.95 23.49,17.33 v1(23.69,17.53)
  Inner1 w0.152: v1(23.69,17.53) 36.92,17.53 39.33,19.94 43.28,19.94 U38.3
I2C1_SDA: length 24.5
  Top Layer w0.152: U1.96 23.49,16.83 v1(23.69,16.63)
  Inner1 w0.152: v1(23.69,16.63) 23.96,16.63 24.6,17.27 37.05,17.27 39.46,19.68 44.02,19.68 U38.4
I2C3_SCL: length 22.8
  Top Layer w0.152: v1(28.92,25.65) 28.06,26.51 U1.67
  Inner1 w0.152: v1(28.92,25.65) 29.93,25.65 34.63,20.95 40.73,20.95 41.28,21.5 45.49,21.5 U38.5
I2C3_SDA: length 23.1
  Top Layer w0.152: U1.66 28.56,26.77 v1(28.92,26.42)
  Inner1 w0.152: U38.6 46.15,21.84 41.11,21.84 40.6,21.34 34.89,21.34 29.81,26.42 v1(28.92,26.42)
INT1_ACCEL: length 10.2
  Top Layer w0.152: U1.55 34.06,29.27 29.68,33.65 29.68,35.88 30.06,36.26 U9.12
INT1_GYRO: length 11.8
  Top Layer w0.152: U1.57 33.06,29.39 29.02,33.42 29.02,35.79 28.87,35.94 28.36,35.94 28.15,36.15 U9.16
LED_TEST_1: length 8.2
  Top Layer w0.152: U1.1 24.06,12.16 23.59,11.69 LED3.1
LED_TEST_2: length 9.5
  Top Layer w0.152: LED4.1 18.58,11.3 23.84,11.3 24.56,12.03 U1.2
LED_TEST_3: length 11.6
  Top Layer w0.152: U1.3 25.06,11.89 24.09,10.92 18.63,10.92 17.87,10.16 17.87,8.81 LED5.1
NRST: length 17.3
  Top Layer w0.152: U1.14 30.57,13.27 30.57,12.19 31.13,11.63 40.54,11.63 SW1.2 v1(42.51,12.13)
  Bottom Layer w0.152: v1(42.51,12.13) 44.23,12.13 R13.1
OSC_IN: length 6.9
  Top Layer w0.152: v1(29.43,11.81) 29.56,11.95 U1.12
  Bottom Layer w0.152: v1(29.43,11.81) 29.43,11.75 C17.1 28.79,11.05 27.65,9.91 27.65,8.64 27.9,8.38 28.09,8.38 X3.1
OSC_OUT: length 7.1
  Top Layer w0.152: U1.13 30.06,11.94 v1(30.19,11.81)
  Bottom Layer w0.152: 30.97,7.31 29.93,8.35 29.93,10.23 C18.1 30.19,11.74 v1(30.19,11.81)
PA0: length 27.8
  Top Layer w0.152: v1(35.06,15.11) U1.23
  Inner1 w0.152: v1(35.06,15.11) 35.7,15.75 41.24,15.75 41.49,15.49 47.33,15.49 47.97,16.13 47.97,21.08 46.83,22.23 42.8,22.23 42.17,22.86 U42.1
PA1: length 26.6
  Top Layer w0.152: U1.24 v1(35.56,14.73)
  Inner1 w0.152: v1(35.56,14.73) 36.32,15.49 41.11,15.49 41.37,15.24 47.46,15.24 48.22,16 48.22,21.23 46.98,22.48 43.65,22.48 43.17,22.96 U42.2
PA2: length 25.5
  Top Layer w0.152: U1.25 v1(36.06,14.35)
  Inner1 w0.152: U42.3 44.17,23.11 44.54,22.73 47.08,22.73 48.48,21.34 48.48,15.9 47.54,14.96 41.26,14.96 40.98,15.24 36.95,15.24 v1(36.06,14.35)
PA3: length 23.1
  Top Layer w0.152: 37.59,14.78 37.61,14.8 ; U1.26 38.35,14.83 38.84,14.33 v1(38.84,14.06)
  Inner1 w0.152: v1(38.84,14.06) 39.76,14.98 40.86,14.98 41.14,14.71 47.69,14.71 48.73,15.75 48.73,21.46 47.21,22.99 45.43,22.99 45.17,23.25 U42.4
PB10: length 7.5
  Top Layer w0.152: U38.1 42.17,21.68 40.67,23.17 40.67,24.19 39.53,25.33 U1.47
PB11: length 8.4
  Top Layer w0.152: U38.2 43.17,21.19 41.02,23.34 41.02,24.35 39.54,25.83 U1.48
PE9: length 6.5
  Top Layer w0.152: v1(39.33,22.99) 39.21,22.99 38.82,22.61 38.82,22.35 38.3,21.83 U1.40
  Inner1 w0.152: v1(39.33,22.99) 40.6,24.26 40.6,24.77 41.17,25.34 42.16,25.34 42.17,25.33
PE11: length 7.8
  Top Layer w0.152: v1(39.33,23.63) 38.53,22.83 U1.42
  Inner1 w0.152: 43.17,25.33 43.17,25.57 42.63,26.1 41.3,26.1 40.28,25.08 40.28,24.32 39.6,23.63 v1(39.33,23.63)
PE13: length 9.2
  Top Layer w0.152: v1(39.33,24.23) 38.7,24.23 38.3,23.83 U1.44
  Inner1 w0.152: v1(39.33,24.23) 39.67,24.23 39.84,24.4 39.84,25.27 41.11,26.54 43.78,26.54 44.17,26.15 44.17,25.33
PE14: length 10
  Top Layer w0.152: U1.45 38.3,24.33 38.8,24.84 v1(39.33,24.84)
  Inner1 w0.152: v1(39.33,24.84) 39.33,25.4 40.86,26.92 44.29,26.92 45.17,26.04 45.17,25.33
POWER: length 24.3
  Top Layer w0.762: 3.31,10.14 3.31,15.3 D4.2 3.14,16.12 2.63,16.64 2.63,26.34 2.57,26.4 2.64,26.47 R6.2 1.23,29.62 1.23,30.61 1.87,31.24 Q29.3 3.9,31.24
RS485_1_A: length 33.5
  Top Layer w0.152: v1(40.22,36.58) 40.74,36.58 40.76,36.55 40.76,36.04 41.23,35.56 41.23,34.12 45.73,29.62 45.73,29.17 45.92,28.97 46.38,28.97 46.57,28.78 46.57,28.33 46.72,28.18 47.18,28.18 47.33,28.02 47.33,27.58 47.49,27.43 47.92,27.43 48.6,26.75 48.6,20.32 48.26,19.98 48.26,16.04 47.71,15.49 46.95,15.49 46.82,15.63 46.82,15.98 47.17,16.33
  Bottom Layer w0.152: v1(40.22,36.58) 39.46,36.58 38.32,37.72 U24.6 38.32,39.25 R186.1
RS485_1_B: length 33.6
  Top Layer w0.152: v1(41.49,36.58) 41.99,36.58 42.01,36.55 42.01,36.04 41.54,35.57 41.54,34.24 48.91,26.87 48.91,20.19 48.56,19.85 48.56,15.91 47.84,15.19 46.83,15.19 46.51,15.5 46.51,15.98 46.17,16.33
  Bottom Layer w0.152: v1(41.49,36.58) 40.86,37.21 40.09,37.21 39.59,37.72 U24.7 39.59,39.49 R186.2
RS485_4_A: length 5.5
  Top Layer w0.152: v1(20.03,37.47) 19.68,37.12 19.68,36.55
  Bottom Layer w0.152: R190.1 19.53,39.88 20.16,39.88 20.54,39.5 U27.6 20.54,37.97 v1(20.03,37.47)
RS485_4_B: length 5.3
  Top Layer w0.152: 20.93,36.55 20.93,37.1 v1(21.3,37.47)
  Bottom Layer w0.152: v1(21.3,37.47) 21.81,37.97 U27.7 21.81,39.5 21.3,40.01 20.91,40.01 R190.2
SPI1_MISO: length 8.4
  Top Layer w0.152: v1(35.9,18.42) 35.9,17.78 36.36,17.33 U1.31
  Bottom Layer w0.152: U22.5 34.61,22.76 35.9,21.46 v1(35.9,18.42)
SPI1_MOSI: length 12.5
  Top Layer w0.152: v1(28.28,20.19) 29.05,19.43 35.78,19.43 36.41,18.8 36.41,18.03 36.62,17.83 U1.32
  Bottom Layer w0.152: U22.2 28.26,20.22 v1(28.28,20.19)
SPI1_NSS: length 14.5
  Top Layer w0.152: v1(28.28,18.95) 34.48,18.95 34.89,18.54 34.89,17.65 36.21,16.33 U1.29
  Bottom Layer w0.152: R184.1 26.53,17.16 U22.1 v1(28.28,18.95)
SPI1_SCK: length 7.8
  Top Layer w0.152: U1.30 36.22,16.83 35.4,17.65 v1(35.4,18.03)
  Bottom Layer w0.152: v1(35.4,18.03) 35.4,20.89 34.79,21.49 U22.6
SPI2_MISO: length 16.4
  Top Layer w0.152: U1.53 35.06,29.8 34.63,30.23 33.49,30.23 29.94,33.78 29.94,35.69 30.23,35.98 30.78,35.98 31.06,36.26 U9.10 31.06,37.5 30.63,37.93 29.13,37.93 28.56,37.36 U9.15
SPI2_MOSI: length 11.6
  Top Layer w0.152: 34.56,29.59 U1.54 ; U9.9 31.56,36.26 31.03,35.73 30.48,35.73 30.19,35.43 30.19,33.91 33.36,30.73 v1(34.56,30.73)
  Bottom Layer w0.152: v1(34.56,30.73) v1(34.56,29.59)
SPI2_SCK: length 13.6
  Top Layer w0.152: U9.8 31.98,36.17 31.23,35.43 30.78,35.43 30.44,35.17 30.44,34.03 33.49,30.99 34,30.99 34.25,31.24 34.76,31.24 35.01,30.99 35.01,30.35 35.56,29.81 U1.52
SWCLK: length 43.3
  Top Layer w0.152: v1(50.25,6.6) R156.1 51.58,6.9 D6.2 ; v1(24.09,26.82) 24.09,26.83 U1.76
  Bottom Layer w0.152: v1(24.09,26.82) 24.63,26.82 25.22,26.23 25.22,24.09 25.81,23.5 28.41,23.5 30.06,21.84 30.06,16.76 30.93,15.9 33.41,15.9 33.74,15.56 33.74,14.73 38.42,10.06 39.94,10.06 42.89,7.11 49.75,7.11 v1(50.25,6.6)
SWDIO: length 43.4
  Top Layer w0.152: U1.72 25.56,26.92 v1(25.56,26.92) ; v1(49.11,7.75) 49.57,7.29 49.57,6.14 50,5.72 50.64,5.72 R157.1 51.28,5.07 51.65,4.7 51.65,3.89 D7.2
  Bottom Layer w0.152: v1(25.56,26.92) 25.57,26.91 25.57,24.29 25.98,23.88 28.61,23.88 30.44,22.04 30.44,16.89 31.08,16.26 33.62,16.26 34.13,15.75 34.13,14.86 38.57,10.41 40.13,10.41 42.79,7.75 v1(49.11,7.75)
TIM2_CH2: length 22.6
  Top Layer w0.152: v1(21.17,20.32) 21.18,20.33 U1.89
  Bottom Layer w0.152: v1(21.17,20.32) 21.17,28.66 23.54,28.66 27.9,33.02 28.28,33.02 28.66,33.4 28.66,35.31 27.56,36.42 R163.1
TIM4_CH1: length 25.7
  Top Layer w0.152: v1(32.35,25.53) 32.35,26.92 32.06,27.21 U1.59
  Bottom Layer w0.152: R178.1 48.35,23.38 48.35,26.54 47.59,27.31 32.86,27.31 32.35,26.8 v1(32.35,25.53)
TIM4_CH2: length 23.8
  Top Layer w0.152: U1.60 31.56,27.08 31.84,26.8 v1(31.84,25.91)
  Bottom Layer w0.152: v1(31.84,25.91) 31.84,26.92 32.6,27.69 47.97,27.69 48.73,26.92 48.73,25.53 49.62,24.64 R179.1
TIM4_CH3: length 22
  Top Layer w0.152: U1.61 31.06,27.12 31.33,26.85 v1(31.33,26.29)
  Bottom Layer w0.152: R180.1 48.74,28.07 32.47,28.07 31.33,26.92 v1(31.33,26.29)
TIM4_CH4: length 22.1
  Top Layer w0.152: v1(30.82,26.67) 30.56,26.93 U1.62
  Bottom Layer w0.152: R181.1 48.36,28.45 32.22,28.45 30.82,27.05 v1(30.82,26.67)
TIM9_CH1: length 32
  Top Layer w0.152: U1.4 v1(25.56,14.86)
  Inner1 w0.152: v1(25.56,14.86) 27.14,14.86 29.55,12.45 40.35,12.45 42.76,10.03 52.79,10.03 v1(52.92,9.91)
  Bottom Layer w0.152: R160.1 53.93,9.91 v1(52.92,9.91)
UART4_RX: length 19.1
  Top Layer w0.152: U1.79 21.24,25.33 20.92,25.65 20.92,30.1 18.5,32.51 v1(18.5,35.05) 22.57,35.05 v1(23.08,34.54)
  Bottom Layer w0.152: R189.1 v1(18.5,35.05) ; U27.1 v1(23.08,34.54)
UART4_TX: length 11.2
  Top Layer w0.152: U1.78 21.38,25.83 21.17,26.03 21.17,30.61 v1(19.77,32)
  Bottom Layer w0.152: v1(19.77,32) 19.27,32.51 U27.4 19.05,33.02 R192.2
UART5_RX: length 29.8
  Top Layer w0.152: v1(3.14,37.59) U36.3 3.14,35.43 3.77,34.8 14.06,34.8 20.41,28.45 20.41,23.88 20.96,23.33 U1.83
  Bottom Layer w0.152: D19.2 v1(3.14,37.59)
UART5_TX: length 27.2
  Top Layer w0.152: v1(4.41,37.59) U36.2 4.41,35.43 4.66,35.18 14.19,35.18 20.66,28.7 20.66,25.27 21.11,24.83 U1.80
  Bottom Layer w0.152: D20.2 v1(4.41,37.59)
USART1_RX: length 19
  Top Layer w0.152: U1.69 27.06,29.11 27.95,30 v1(27.95,30.98) ; v1(37.07,31.61) 40.08,31.61 v1(40.43,31.96)
  Bottom Layer w0.152: v1(40.43,31.96) 40.86,32.39 U24.1 42.6,33.11 R185.1 ; v1(37.07,31.61) 30.17,31.61 29.54,30.98 28.66,30.98 28.6,30.92 28.22,30.92 28.16,30.98 v1(27.95,30.98)
USART1_TX: length 20.7
  Top Layer w0.152: v1(40.67,35.18) 37.55,35.18 v1(37.05,34.67) ; U1.68 27.56,29.12 28.41,29.97 v1(28.41,31.37)
  Bottom Layer w0.152: v1(28.41,31.37) 29.43,31.37 29.93,31.88 36.54,31.88 37.05,32.39 U24.4 v1(37.05,34.67) ; v1(40.67,35.18) 42.26,35.18 R188.2
USART2_RX: length 29.6
  Top Layer w0.152: U1.87 20.4,21.33 19.39,20.32 19.39,16.64 17.87,15.11 12.54,15.11 11.39,13.97 11.39,8.51 10.12,7.24 8.22,7.24 6.92,5.94 6.92,5.46 6.95,5.43 v1(6.95,4.32)
  Bottom Layer w0.152: D23.2 v1(6.95,4.32)
USART2_TX: length 30.9
  Top Layer w0.152: 5.67,5.46 5.68,5.45 v1(5.68,4.32) ; U1.86 20.39,21.83 19.14,20.57 19.14,16.74 17.89,15.49 12.54,15.49 11.14,14.1 11.14,8.64 10,7.49 7.2,7.49 5.67,5.96 5.67,5.71
  Bottom Layer w0.152: D24.2 v1(5.68,4.32)
USART6_RX: length 47.9
  Top Layer w0.152: U1.64 29.56,27.06 v1(29.55,27.05)
  Bottom Layer w0.152: 51.04,15.49 Q6.3 ; 51.04,15.49 51.04,14.89 50.38,14.22 48.57,14.22 48.1,13.75 48.1,9.27 47.33,8.51 42.51,8.51 40.22,10.8 38.7,10.8 34.51,14.99 34.51,15.88 33.79,16.59 31.25,16.59 30.82,17.02 30.82,25.78 v1(29.55,27.05) ; 51.04,15.49 51.04,17.26 51.79,18.01 R154.2
USB-DM: length 11.8
  Top Layer w0.254: USB1.B7 51,35.7 50.89,35.81 v1(50.89,36.2) 50.89,36.55 51.03,36.7 USB1.A7
  Bottom Layer w0.254: R182.1 55.6,36.96 51.65,36.96 v1(50.89,36.2) 49.89,36.2 48.54,34.85
USB-DP: length 13.7
  Top Layer w0.254: USB1.A6 53.22,36.2 53.39,36.37 53.39,36.73 52.95,37.17 52.15,37.17 USB1.B6
  Bottom Layer w0.254: 48.54,32.46 49.49,33.41 49.49,35.18 50,35.69 52.75,35.69 v1(53.37,36.31) 53.64,36.58 55.09,36.58 R183.1
USB_VBUS: length 12.6
  Top Layer w0.254: USB1.B9 53.08,34.15 54.57,35.64 v1(54.57,35.69) 54.57,37.26 53.1,38.73 52.44,38.73 USB1.A9
  Bottom Layer w0.254: v1(54.57,35.69) 54.57,35.3 U20.2 54.01,34.85 D8.4
USER_KEY: length 18.5
  Top Layer w0.152: v1(46.06,12.18) SW2.1 v1(45.17,13.59) ; v1(41.36,13.61) 41.36,13.08 40.22,11.94 31.59,11.94 31.06,12.46 U1.15
  Bottom Layer w0.152: v1(41.36,13.61) 45.16,13.61 v1(45.17,13.59)
WP: length 4.4
  Top Layer w0.152: U1.85 24.39,22.33 v1(25.23,21.49)
  Bottom Layer w0.152: v1(25.23,21.49) U22.3
$1N2558: length 1.7
  Top Layer w0.254: R14.2 15.59,13.46 LED2.2
$1N3908: length 4.2
  Top Layer w0.152: 41.49,26.86 40.79,26.86 40.09,26.16 39.08,26.16 38.91,26.33 U1.49
$1N3911: length 4.6
  Top Layer w0.152: C185.1 25.87,31.31 25.87,29.88 25.46,29.46 25.24,29.46 25.06,29.29 U1.73
$1N10722: length 2.5
  Top Layer w0.152: R157.2 53.29,4.57 53.68,4.57 54.16,4.09 CN1.1
$1N10751: length 2.7
  Top Layer w0.152: R156.2 53.42,5.97 53.56,5.97 54.18,5.34 CN1.2
$1N15439: length 41.1
  Top Layer w0.152: U1.70 26.56,29.03 26.46,29.12 26.46,29.65 26.65,29.84 26.86,29.84 v1(27,29.7)
  Bottom Layer w0.152: R182.2 58.13,36.7 58.5,36.7 59.02,36.18 59.02,33.76 58.23,32.97 56.3,32.97 54.19,30.86 49.69,30.86 49.21,30.38 49.13,30.38 49,30.24 49,30.17 47.57,28.74 33.96,28.74 32.87,29.83 27.03,29.83 27,29.8 v1(27,29.7)
$1N15440: length 41.2
  Top Layer w0.152: v1(27.01,30.35) 26.83,30.18 26.56,30.18 26.16,29.78 26.16,29.12 26.06,29.02 U1.71
  Bottom Layer w0.152: R183.2 57.48,35.81 58.07,36.39 58.38,36.39 58.71,36.05 58.71,33.89 58.1,33.27 56.17,33.27 54.07,31.17 49.49,31.17 47.37,29.04 43.05,29.04 42.76,29.34 42.47,29.34 42.18,29.04 41.91,29.04 41.91,29.05 41.62,29.34 41.4,29.34 41.11,29.04 34.09,29.04 32.98,30.15 27.21,30.15 v1(27.01,30.35)
$2N1752: length 2.1
  Top Layer w0.254: C3.2 6.22,18.44 R152.1
$2N1755: length 2.5
  Top Layer w0.254: C4.1 9.66,26.75 8.85,27.56 8.49,27.56 R4.1
$2N1757: length 9
  Top Layer w0.254: 7.77,24.53 7.77,23.69 7.33,23.24 6.25,23.24 5.51,22.5 R3.1 4.15,22.51 4.15,23.5 4.47,23.81 Q30.1
$2N2663: length 1.5
  Bottom Layer w0.254: U4.1 6.48,15.77 C8.1
$3N1653: length 2.2
  Bottom Layer w0.152: R155.1 53.29,13.02 Q6.1
$3N1654: length 1.9
  Bottom Layer w0.152: U18.1 R155.2
$3N2642: length 5.4
  Bottom Layer w0.152: 58.55,5.08 58.89,5.42 U19.2
  Bottom Layer w0.254: U19.2 57.88,8.13 57.64,8.13 Q31.3
$3N2793: length 5.9
  Top Layer w0.152: v1(58.38,12.08) 58.14,12.32 v1(56.27,12.32)
  Bottom Layer w0.152: v1(58.38,12.08) 59.01,11.45 R159.1 ; v1(56.27,12.32) 55.6,11.65 Q31.1 55.52,11.45 R160.2
$3N2963: length 5.7
  Top Layer w0.254: USB1.A5 53.07,35.2 v1(53.43,35.56)
  Bottom Layer w0.254: 55.98,34.04 55.21,34.81 55.21,35.81 54.83,36.2 54.06,36.2 v1(53.43,35.56)
$3N2969: length 5.4
  Top Layer w0.254: USB1.B5 52.15,38.17 53.03,38.17 53.27,37.93 v1(53.27,37.58)
  Bottom Layer w0.254: 55.98,38.99 55.21,38.22 55.21,37.72 54.83,37.34 53.46,37.34 53.27,37.52 v1(53.27,37.58)
$3N3573: length 6.1
  Bottom Layer w0.254: R163.2 29.09,37.93 29.12,37.9 29.12,37.67 29.83,36.96 31.59,36.96 32.56,37.93 R164.1
$3N3908: length 19.9
  Top Layer w0.508: 30.9,41.03 30.9,41.03 30.9,40.26 ; 30.9,41.03 28.67,41.03 28.36,40.72 R168.1 27.57,40.26 R167.1 R166.1 R165.1 R174.1 ; 30.9,41.03 32.73,41.03 33.18,40.57 R170.1 R171.1 R172.1 R173.1 32.93,35.56 32.31,35.56 v1(32.31,35.56)
  Bottom Layer w0.508: Q32.3 30.2,35.56 v1(32.31,35.56)
$3N4093: length 1.7
  Top Layer w0.254: LED3.2 13.93,11.69 R175.2
$3N4149: length 1.7
  Top Layer w0.254: LED4.2 13.93,9.91 R176.2
$3N4204: length 1.7
  Top Layer w0.254: R177.2 13.93,8.13 LED5.2
$3N4509: length 3.9
  Bottom Layer w0.152: H2.1 51.54,21.69 R178.2
  Bottom Layer w0.254: R178.2 51.02,22.1 50.38,21.46 50.38,21.28 D10.2
$3N4516: length 3.8
  Bottom Layer w0.152: H2.2 51.54,24.23 R179.2
  Bottom Layer w0.254: R179.2 51.13,24.58 D11.2
$3N4547: length 3.8
  Bottom Layer w0.152: H2.3 51.54,26.77 R180.2
  Bottom Layer w0.254: R180.2 51.13,27.12 D12.2
$3N4554: length 3.8
  Bottom Layer w0.152: R181.2 51.54,29.31 H2.4
  Bottom Layer w0.254: R181.2 51.13,29.66 D13.2
$3N10667: length 4.8
  Bottom Layer w0.152: R188.1 44.15,37.17 42.45,38.87
$3N10700: length 16.2
  Top Layer w0.152: v1(38.32,34.42) 38.44,34.54 v1(40.67,34.54)
  Bottom Layer w0.152: v1(40.67,34.54) 41.24,34.54 41.75,34.04 43.04,34.04 43.4,34.39 Q33.3 41.62,38.35 41.62,39.4 41.97,39.75 44.08,39.75 R187.1 ; v1(38.32,34.42) U24.3
$3N11131: length 6.5
  Bottom Layer w0.152: R192.1 15.2,33.92 15.2,35.69 15.9,36.39 15.9,38.87
$3N11141: length 11.5
  Bottom Layer w0.152: R191.1 16.85,39.51 Q34.3 16.85,34.54 17.23,34.16 18.25,34.16 18.63,34.54 19.9,34.54 20.54,33.91 U27.3

## Copper pours and planes (outline as drawn; the poured copper is in the pictures)
GND on Top Layer: 14.56,30.24 40.46,30.24 40.48,30.23 40.48,14.73 48.48,14.73 48.48,7.24 14.56,7.24
GND on Top Layer: -2.3,45.32 63.23,45.32 63.36,45.45 63.36,-2.68 62.97,-3.06 -1.92,-3.06 -2.94,-4.08 -2.94,44.69
GND on Bottom Layer: -3.33,43.63 63.47,43.63 63.59,43.5 63.59,-1.97 61.69,-3.87 -3.72,-3.87 -3.72,43.24
GND on Inner1: -3.12,43.68 62.93,43.68 63.37,43.24 63.37,-0.82 60.83,-3.36 -2.92,-3.36 -3.12,-3.17
GND on Inner2: 0.26,41.5 16.47,41.5 16.47,35.81 0.26,35.81
GND on Inner2: 0.26,27.78 59.91,27.78 59.91,0.26 0.26,0.26
VCC_3.3V on Inner2: 0.26,41.48 47.81,41.48 47.81,9.4 0.26,9.4
VCC_5V on Top Layer: 11.53,27.56 14.19,27.56 14.19,21.08 11.53,21.08
VCC_5V on Bottom Layer: 11.55,30.44 15.75,30.44 15.75,15.88 11.77,15.88 11.77,24.74 11.55,24.74
VCC_5V on Bottom Layer: 14.06,18.67 16.6,18.67 16.6,15.88 13.81,15.88 13.81,18.42
VCC_5V on Inner2: 10.98,41.46 59.91,41.46 59.91,3.62 10.98,3.62
VCC_24V on Top Layer: 5.17,33.4 7.2,33.4 7.2,31.88 9.7,31.88 9.7,29.56 7.07,29.56 7.07,29.56 7.07,27.81 5.69,27.81 5.69,30.71 5.17,30.71
VCC_24V on Bottom Layer: 4.53,33.4 7.33,33.4 7.33,30.73 5.22,30.73 5.22,22.74 5.18,22.7 4.28,22.7 4.28,20.06 3.14,20.06 3.14,33.41 4.53,33.41
VCC_24V on Inner2: 4.16,41.45 39.08,41.45 39.08,30.76 4.16,30.76
$2N2664 on Bottom Layer: 5.68,30.45 9.74,30.45 9.74,15.11 7.19,15.11 7.19,16.76 9.1,16.76 9.1,20.07 4.57,20.07 4.57,22.5 5.66,22.5 5.68,22.48

## Text on the board
Bottom Silkscreen Layer: SPI1 | TIM2_CH2 | TIM9_CH1 | H L
Top Silkscreen Layer: X | Y | Z | LED_POWER | PE3 | PE4 | PE2 | SPI1 | CAN2 | CAN1 | RESET | PC0_KEY | TIM4_CH4 | TIM4_CH3 | TIM4_CH2 | TIM4_CH1 | UART5 | UART4 | USART1 | USART2 | VCC_5V | VCC_3.3V | L H | USART6 | G T R | VCC_24V | V G T R | L H G V | P     V     G | D     V     G | D C G V | B A G
